# Altium schematic sheet POWER.SchDoc
size A; SheetNumber: 1; SheetTotal: 2
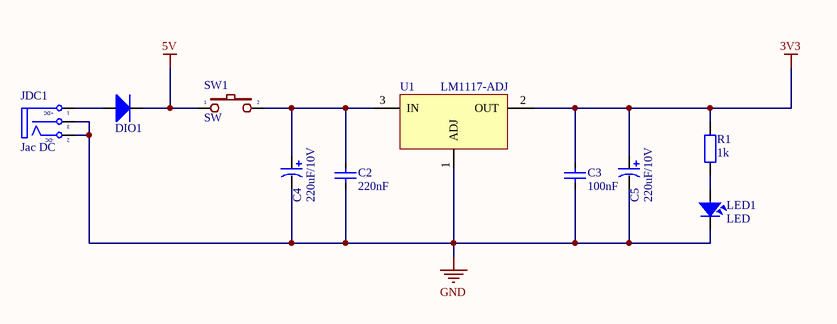
[diagram p0: POWER.SchDoc]

## Parts
C2  220nF  [CAP_0805]
C3  100nF  [CAP_0805]
C4  220uF/10V  [CAP_7343]
C5  220uF/10V  [CAP_7343]
DIO1  Diode SMD  [DIO-214AC(SMA)]  (value not drawn)
JDC1  Jac DC  [DC-IN]
LED1  LED  [LED-0805-Red]
R1  1k  [RES-SMD-0805]
SW1  SW  [SW2]
U1  LM1117-ADJ  [LM1117-SOP]

## Nets
3V3: C3.2 C5.1 R1.1 U1.2(OUT)
5V: DIO1.2(K) SW1.1
GND: C2.1 C3.1 C4.2 C5.2 JDC1.2(TN) JDC1.3(S) LED1.2 U1.1(ADJ)
NetC2_2: C2.2 C4.1 SW1.2 U1.3(IN)
NetDIO1_1: DIO1.1(A) JDC1.1(T)
NetLED1_1: LED1.1 R1.2

## Notes on the sheet
- (in symbol DCIN) +DC; -DC

## Library data of the parts
C2 C3 = CapSMD: Capacitor; Value: 33p; Published: 8-Jun-2000; LatestRevisionDate: 17-Jul-2002; LatestRevisionNote: Re-released for DXP Platform.; PackageReference: RAD-0.3; Publisher: Altium Limited
C4 C5 = CAP_TAN_SMD: Polazied Tantalum Capacitor
DIO1 = Diode SMD: Default Diode; Code - JEDEC: DO-214-AB; Value: 1N5007; Published: 8-Jun-2000; Revision: July-2002: Re-released for DXP Platform.; Publisher: Altium Limited
JDC1 = DCIN: Jac DC input; Value: Jac DC
LED1 = LED: LED Single colour Green and Red; Value: LED 3 ly Single Colour
R1 = Resistor - SMD: Resistor SMD; Manufacturer: Generic Components; Class: Passive; Published: 08/06/2000; Publisher: Altium Hobart Technology Centre
SW1 = SW2: Switch button 2 pin; Value: SW chip 2 pin
U1 = LM1117-ADJ: 800mA Low-Dropout Linear Regulator; Creator: Nguyen Ba Bien; Website: http://group3i.net